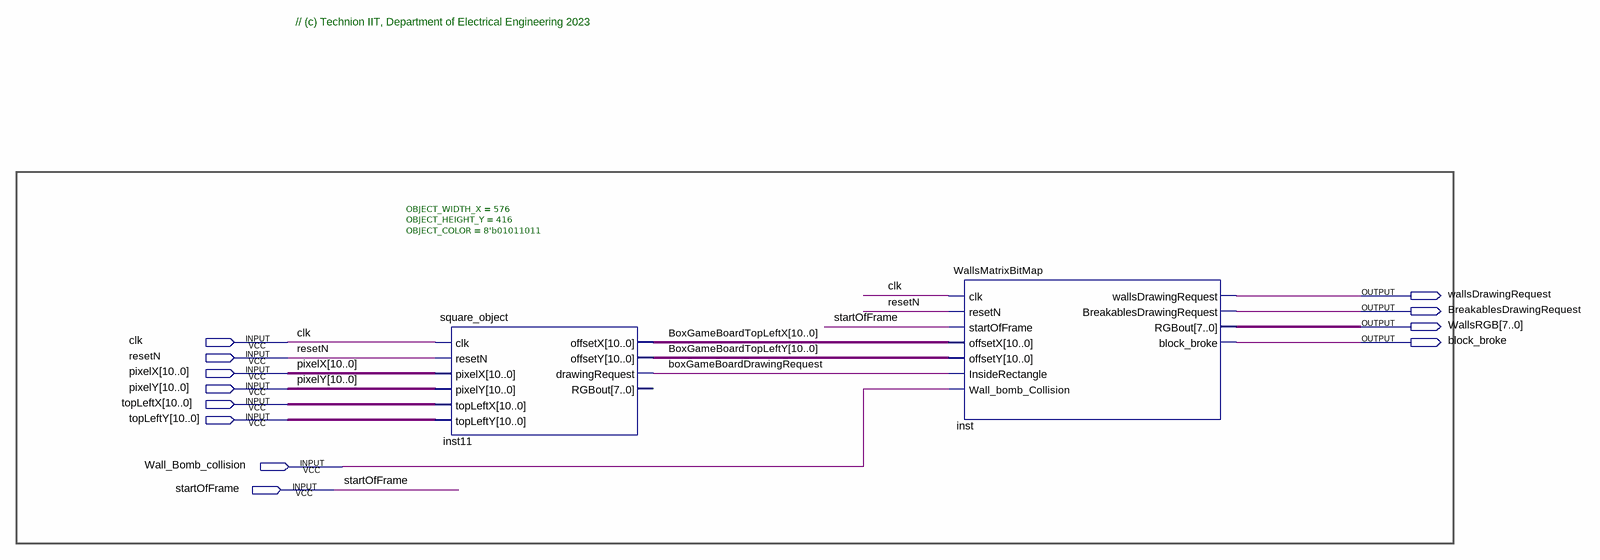
[diagram p0: schematic sheet]
// Quartus schematic WALL_DISPLAY.bdf as structural Verilog: 2 symbols, 12 pins
module WALL_DISPLAY (
  input  clk,
  input  resetN,
  input  [10:0] pixelX,
  input  [10:0] pixelY,
  input  [10:0] topLeftX,
  input  [10:0] topLeftY,
  input  Wall_Bomb_collision,
  input  startOfFrame,
  output wallsDrawingRequest,
  output BreakablesDrawingRequest,
  output [7:0] WallsRGB,
  output block_broke
);

  wire boxGameBoardDrawingRequest;
  wire [10:0] BoxGameBoardTopLeftX, BoxGameBoardTopLeftY;

  square_object #(.OBJECT_WIDTH_X(576), .OBJECT_HEIGHT_Y(416), .OBJECT_COLOR(8'b01011011)) inst11 (
    .clk(clk), .resetN(resetN), .pixelX(pixelX), .pixelY(pixelY), .topLeftX(topLeftX), .topLeftY(topLeftY),
    .offsetX(BoxGameBoardTopLeftX), .offsetY(BoxGameBoardTopLeftY),
    .drawingRequest(boxGameBoardDrawingRequest));  // open: RGBout
  WallsMatrixBitMap inst (
    .clk(clk), .resetN(resetN), .startOfFrame(startOfFrame), .offsetX(BoxGameBoardTopLeftX),
    .offsetY(BoxGameBoardTopLeftY), .InsideRectangle(boxGameBoardDrawingRequest),
    .Wall_bomb_Collision(Wall_Bomb_collision), .wallsDrawingRequest(wallsDrawingRequest),
    .BreakablesDrawingRequest(BreakablesDrawingRequest), .RGBout(WallsRGB), .block_broke(block_broke));

  // Notes on the sheet:
  //   // (c) Technion IIT, Department of Electrical Engineering 2023
endmodule
